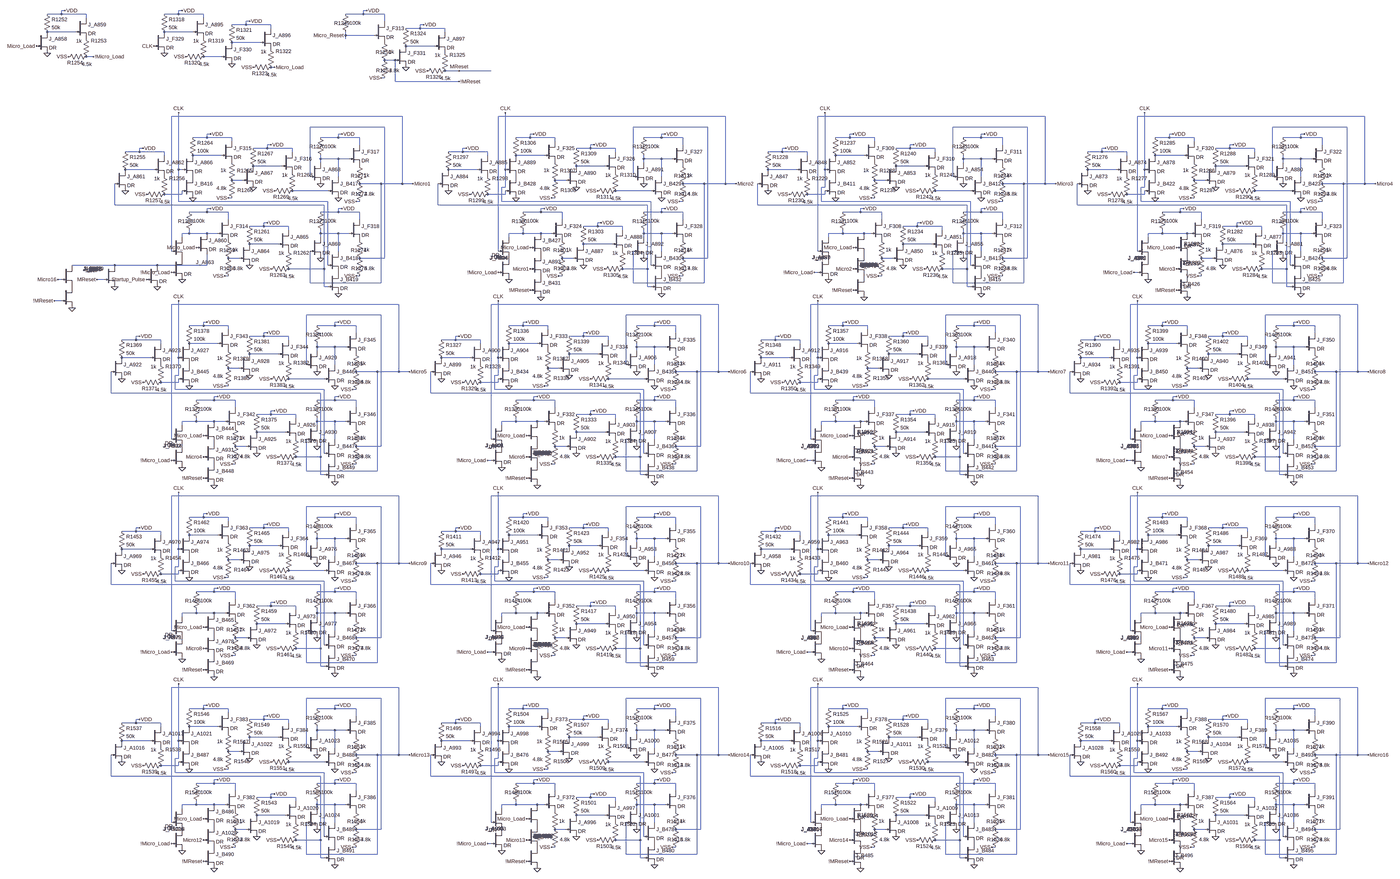
[diagram p0: schematic step_counter.asc, whole sheet]
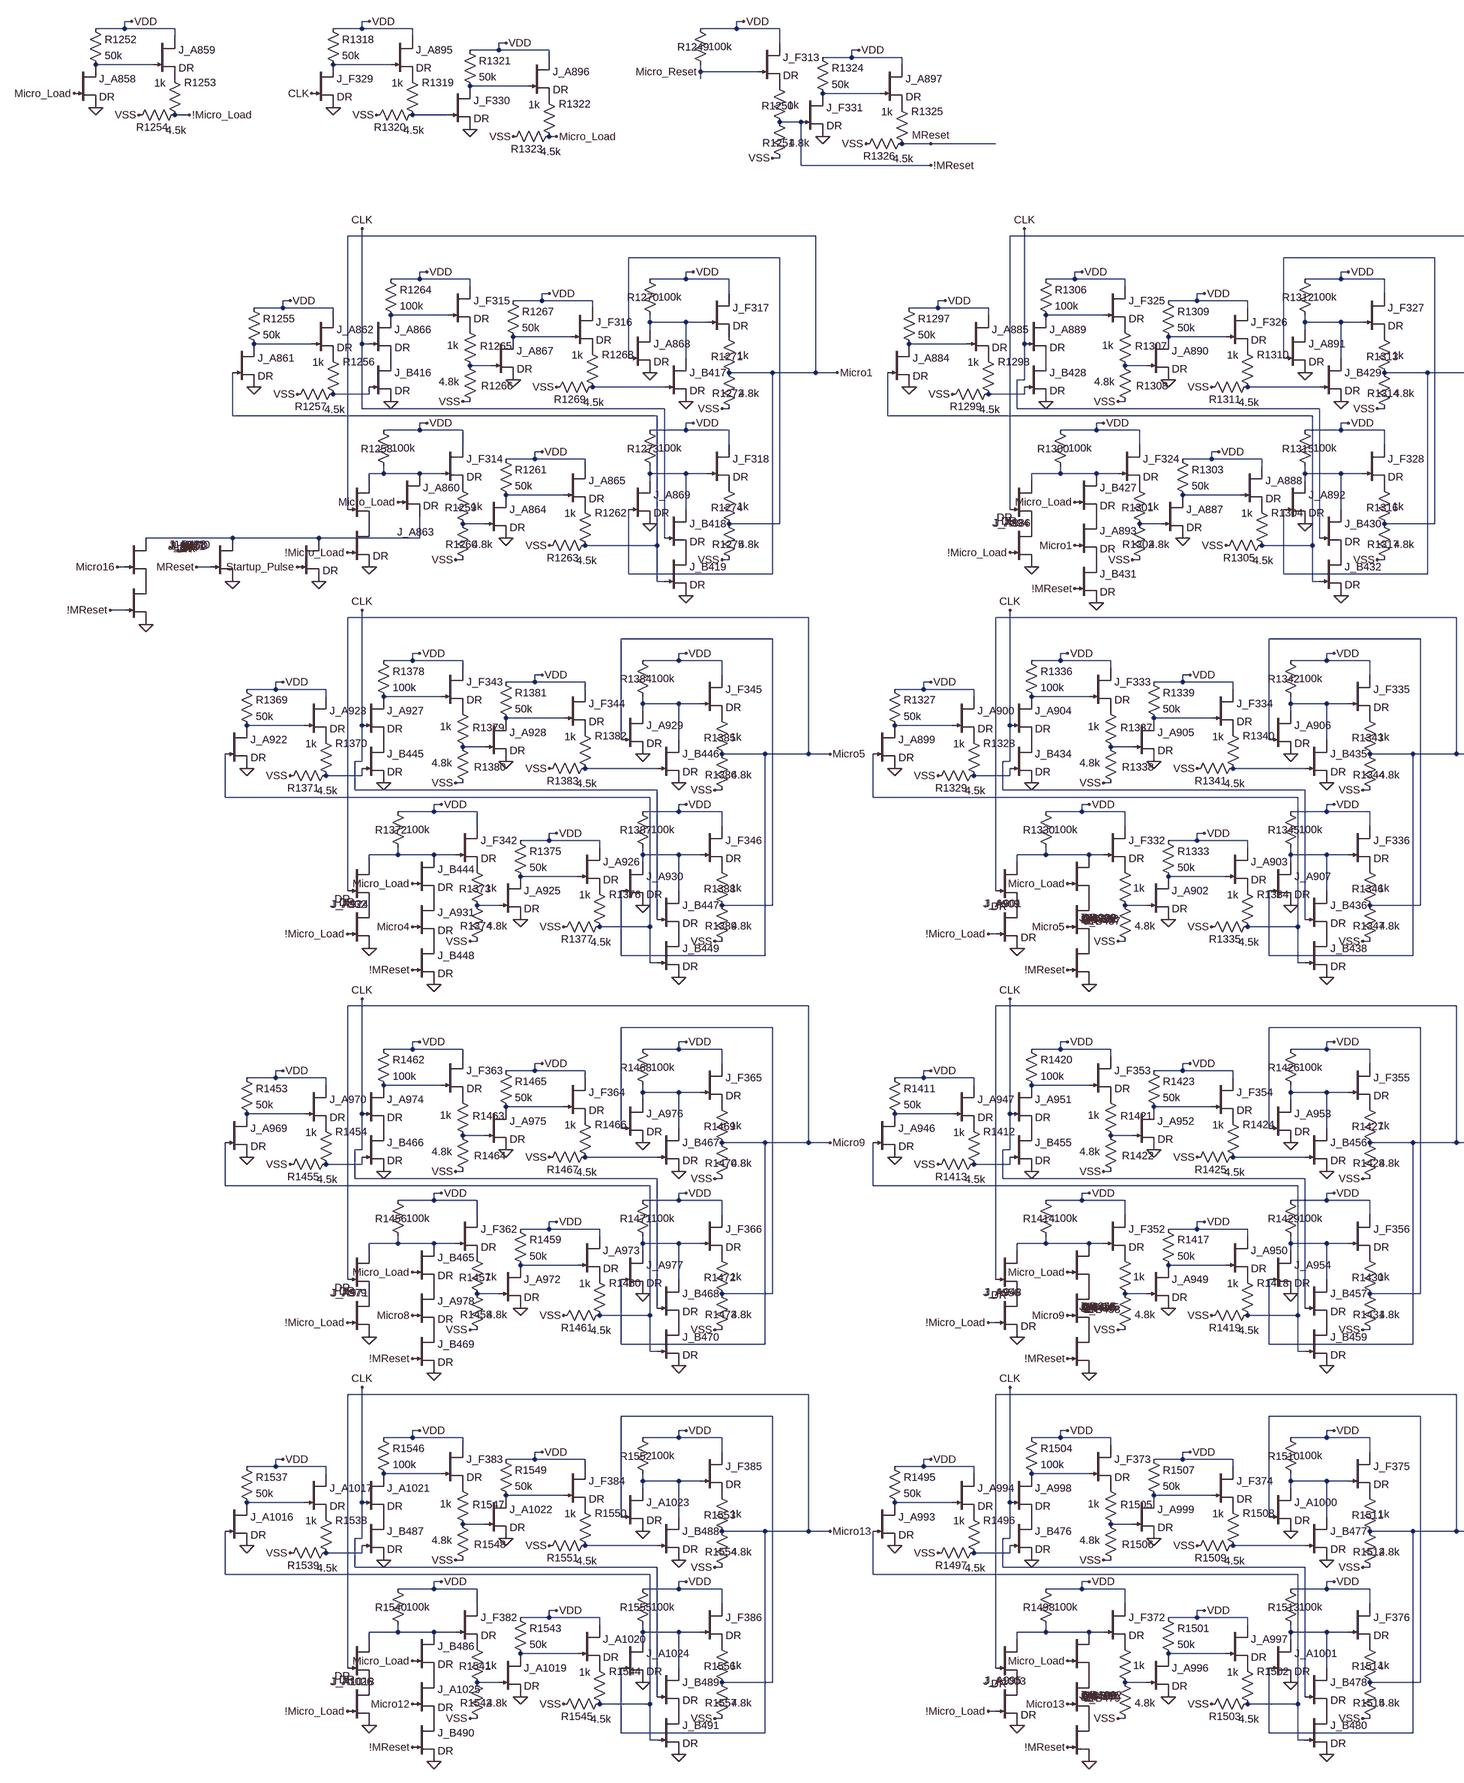
[diagram p1: schematic step_counter.asc, part, row 1 of 1, column 1 of 2]
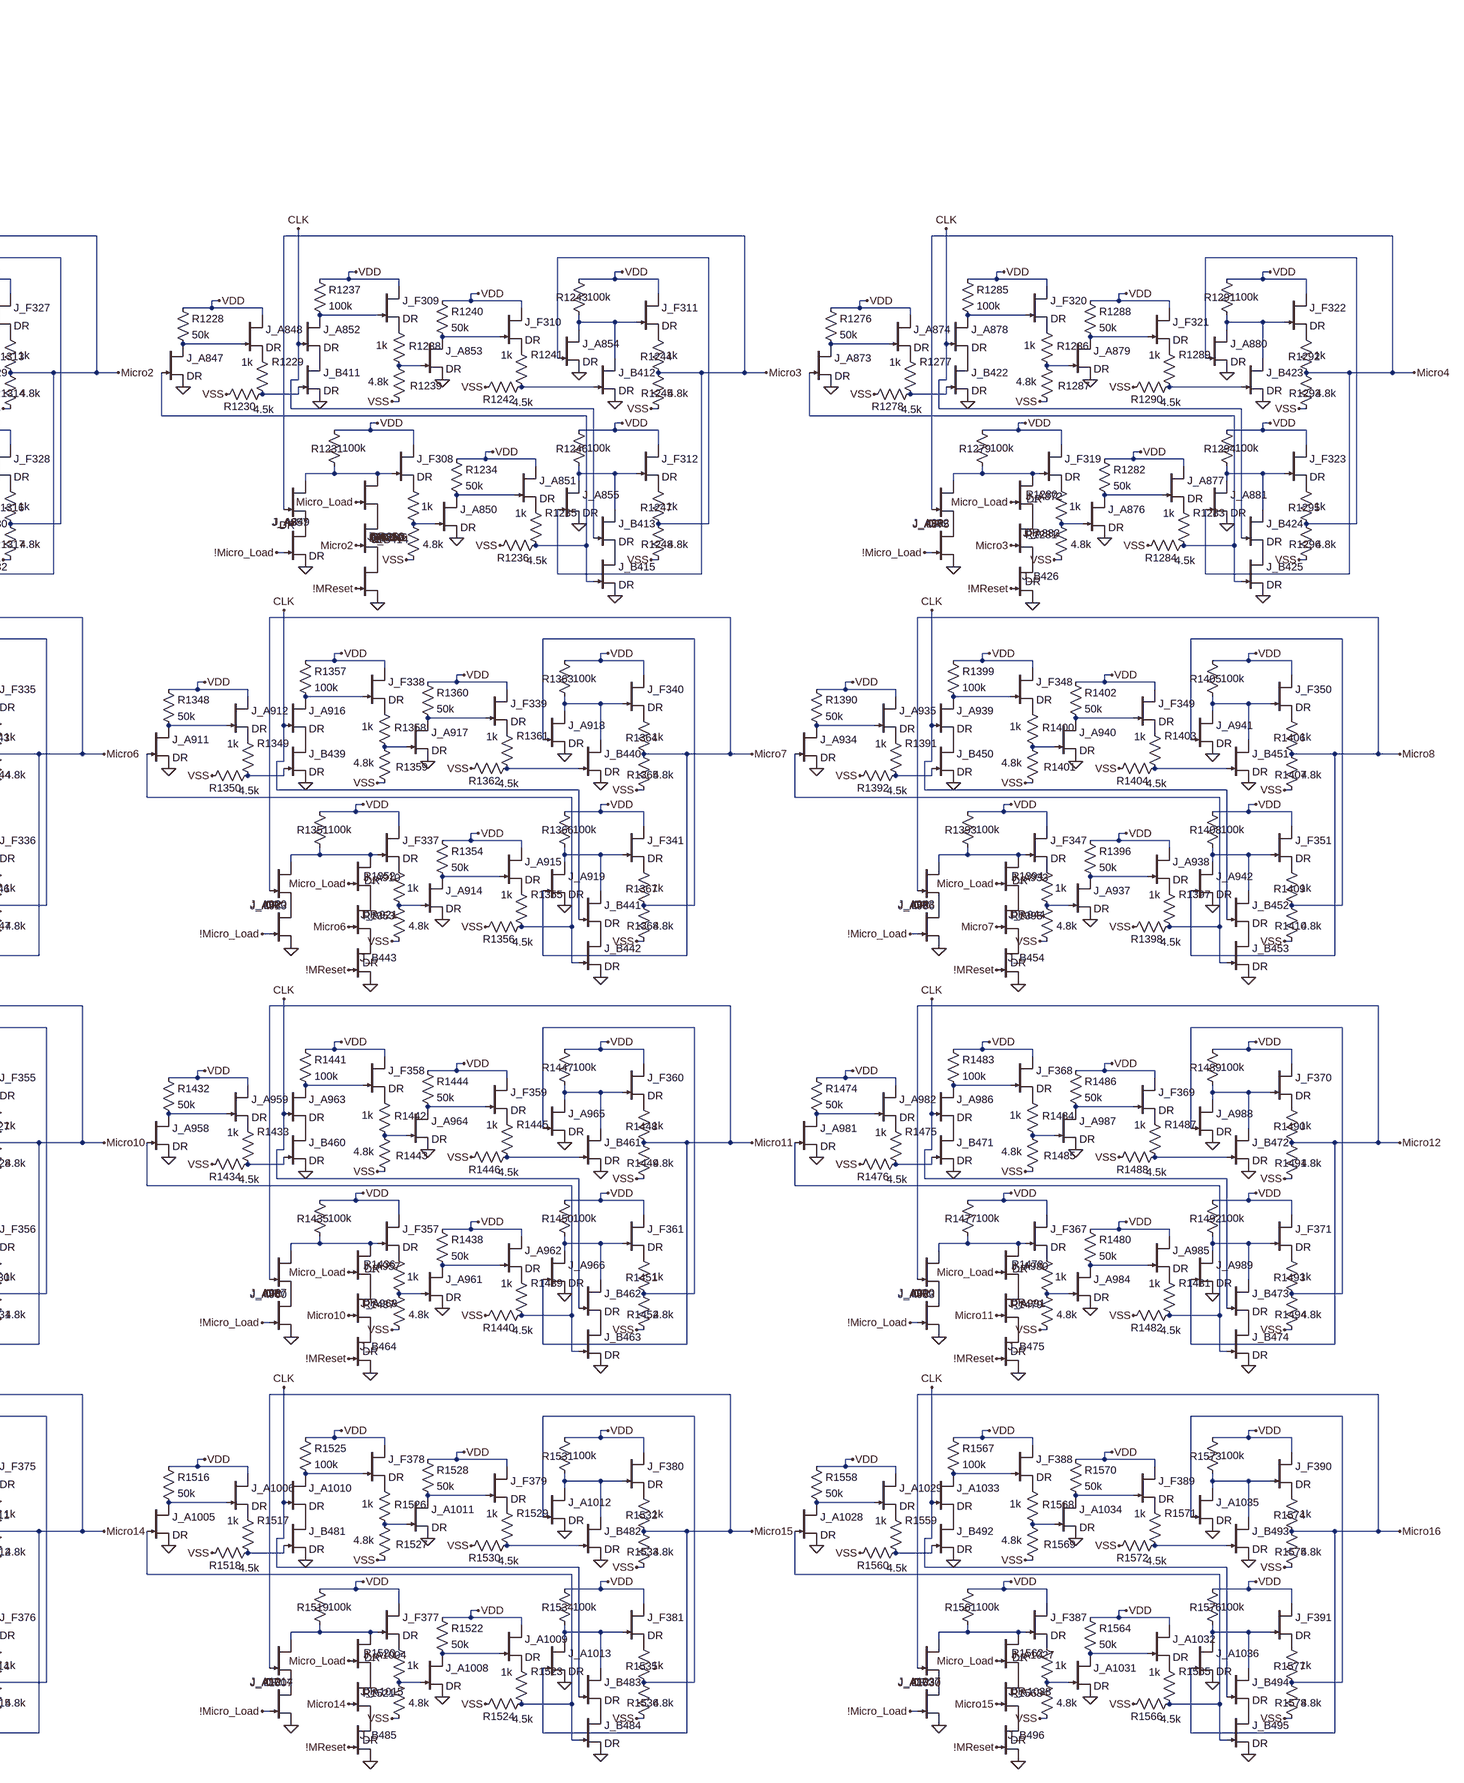
[diagram p2: schematic step_counter.asc, part, row 1 of 1, column 2 of 2]
* step_counter.asc
J_A846 N046 Micro_Load P001 DR
J_A847 N024 N040 0 DR
R1228 VDD N024 50k
J_A848 VDD N024 P002 DR
R1229 P002 N036 1k
R1230 N036 VSS 4.5k
J_A849 P003 !Micro_Load 0 DR
R1231 VDD N046 100k
J_F308 VDD N046 P004 DR
R1232 P004 N056 1k
R1233 N056 VSS 4.8k
J_A850 N052 N056 0 DR
R1234 VDD N052 50k
J_A851 VDD N052 P005 DR
R1235 P005 N040 1k
R1236 N040 VSS 4.5k
J_A852 N012 CLK P006 DR
R1237 VDD N012 100k
J_F309 VDD N012 P007 DR
R1238 P007 N028 1k
R1239 N028 VSS 4.8k
J_B411 P006 N036 0 DR
J_A853 N020 N028 0 DR
R1240 VDD N020 50k
J_F310 VDD N020 P008 DR
R1241 P008 N032 1k
R1242 N032 VSS 4.5k
J_A854 N016 N008 0 DR
R1243 VDD N016 100k
J_F311 VDD N016 P009 DR
R1244 P009 Micro3 1k
R1245 Micro3 VSS 4.8k
J_B412 N016 N032 0 DR
J_A855 N047 Micro3 0 DR
R1246 VDD N047 100k
J_F312 VDD N047 P010 DR
R1247 P010 N008 1k
R1248 N008 VSS 4.8k
J_B413 N047 CLK P011 DR
J_A856 P001 Micro2 P012 DR
J_B414 P012 !MReset 0 DR
R1249 VDD Micro_Reset 100k
J_F313 VDD Micro_Reset P013 DR
R1250 P013 !MReset 1k
R1251 !MReset VSS 4.8k
J_A857 N046 Micro3 P003 DR
J_B415 P011 N040 0 DR
J_A858 N001 Micro_Load 0 DR
R1252 VDD N001 50k
J_A859 VDD N001 P014 DR
R1253 P014 !Micro_Load 1k
R1254 !Micro_Load VSS 4.5k
J_A860 N042 Micro_Load N058 DR
J_A861 N022 N038 0 DR
R1255 VDD N022 50k
J_A862 VDD N022 P015 DR
R1256 P015 N034 1k
R1257 N034 VSS 4.5k
J_A863 P016 !Micro_Load 0 DR
R1258 VDD N042 100k
J_F314 VDD N042 P017 DR
R1259 P017 N054 1k
R1260 N054 VSS 4.8k
J_A864 N050 N054 0 DR
R1261 VDD N050 50k
J_A865 VDD N050 P018 DR
R1262 P018 N038 1k
R1263 N038 VSS 4.5k
J_A866 N010 CLK P019 DR
R1264 VDD N010 100k
J_F315 VDD N010 P020 DR
R1265 P020 N026 1k
R1266 N026 VSS 4.8k
J_B416 P019 N034 0 DR
J_A867 N018 N026 0 DR
R1267 VDD N018 50k
J_F316 VDD N018 P021 DR
R1268 P021 N030 1k
R1269 N030 VSS 4.5k
J_A868 N014 N006 0 DR
R1270 VDD N014 100k
J_F317 VDD N014 P022 DR
R1271 P022 Micro1 1k
R1272 Micro1 VSS 4.8k
J_B417 N014 N030 0 DR
J_A869 N043 Micro1 0 DR
R1273 VDD N043 100k
J_F318 VDD N043 P023 DR
R1274 P023 N006 1k
R1275 N006 VSS 4.8k
J_B418 N043 CLK P024 DR
J_A870 N042 Micro1 P016 DR
J_B419 P024 N038 0 DR
J_B420 N058 Startup_Pulse 0 DR
J_A871 N058 Micro16 P025 DR
J_B421 P025 !MReset 0 DR
J_A872 N048 Micro_Load P026 DR
J_A873 N025 N041 0 DR
R1276 VDD N025 50k
J_A874 VDD N025 P027 DR
R1277 P027 N037 1k
R1278 N037 VSS 4.5k
J_A875 P028 !Micro_Load 0 DR
R1279 VDD N048 100k
J_F319 VDD N048 P029 DR
R1280 P029 N057 1k
R1281 N057 VSS 4.8k
J_A876 N053 N057 0 DR
R1282 VDD N053 50k
J_A877 VDD N053 P030 DR
R1283 P030 N041 1k
R1284 N041 VSS 4.5k
J_A878 N013 CLK P031 DR
R1285 VDD N013 100k
J_F320 VDD N013 P032 DR
R1286 P032 N029 1k
R1287 N029 VSS 4.8k
J_B422 P031 N037 0 DR
J_A879 N021 N029 0 DR
R1288 VDD N021 50k
J_F321 VDD N021 P033 DR
R1289 P033 N033 1k
R1290 N033 VSS 4.5k
J_A880 N017 N009 0 DR
R1291 VDD N017 100k
J_F322 VDD N017 P034 DR
R1292 P034 Micro4 1k
R1293 Micro4 VSS 4.8k
J_B423 N017 N033 0 DR
J_A881 N049 Micro4 0 DR
R1294 VDD N049 100k
J_F323 VDD N049 P035 DR
R1295 P035 N009 1k
R1296 N009 VSS 4.8k
J_B424 N049 CLK P036 DR
J_A882 N048 Micro4 P028 DR
J_B425 P036 N041 0 DR
J_A883 P026 Micro3 P037 DR
J_B426 P037 !MReset 0 DR
J_A884 N023 N039 0 DR
R1297 VDD N023 50k
J_A885 VDD N023 P038 DR
R1298 P038 N035 1k
R1299 N035 VSS 4.5k
J_A886 P039 !Micro_Load 0 DR
R1300 VDD N044 100k
J_F324 VDD N044 P040 DR
R1301 P040 N055 1k
R1302 N055 VSS 4.8k
J_B427 N044 Micro_Load P041 DR
J_A887 N051 N055 0 DR
R1303 VDD N051 50k
J_A888 VDD N051 P042 DR
R1304 P042 N039 1k
R1305 N039 VSS 4.5k
J_A889 N011 CLK P043 DR
R1306 VDD N011 100k
J_F325 VDD N011 P044 DR
R1307 P044 N027 1k
R1308 N027 VSS 4.8k
J_B428 P043 N035 0 DR
J_A890 N019 N027 0 DR
R1309 VDD N019 50k
J_F326 VDD N019 P045 DR
R1310 P045 N031 1k
R1311 N031 VSS 4.5k
J_A891 N015 N007 0 DR
R1312 VDD N015 100k
J_F327 VDD N015 P046 DR
R1313 P046 Micro2 1k
R1314 Micro2 VSS 4.8k
J_B429 N015 N031 0 DR
J_A892 N045 Micro2 0 DR
R1315 VDD N045 100k
J_F328 VDD N045 P047 DR
R1316 P047 N007 1k
R1317 N007 VSS 4.8k
J_B430 N045 CLK P048 DR
J_A893 P041 Micro1 P049 DR
J_B431 P049 !MReset 0 DR
J_A894 N044 Micro2 P039 DR
J_B432 P048 N039 0 DR
R1318 VDD N002 50k
J_A895 VDD N002 P050 DR
R1319 P050 N005 1k
R1320 N005 VSS 4.5k
J_F329 N002 CLK 0 DR
R1321 VDD N003 50k
J_A896 VDD N003 P051 DR
R1322 P051 Micro_Load 1k
R1323 Micro_Load VSS 4.5k
J_F330 N003 N005 0 DR
J_B433 N058 MReset 0 DR
R1324 VDD N004 50k
J_A897 VDD N004 P052 DR
R1325 P052 MReset 1k
R1326 MReset VSS 4.5k
J_F331 N004 !MReset 0 DR
J_A898 N097 Micro_Load P053 DR
J_A899 N076 N092 0 DR
R1327 VDD N076 50k
J_A900 VDD N076 P054 DR
R1328 P054 N088 1k
R1329 N088 VSS 4.5k
J_A901 P055 !Micro_Load 0 DR
R1330 VDD N097 100k
J_F332 VDD N097 P056 DR
R1331 P056 N108 1k
R1332 N108 VSS 4.8k
J_A902 N104 N108 0 DR
R1333 VDD N104 50k
J_A903 VDD N104 P057 DR
R1334 P057 N092 1k
R1335 N092 VSS 4.5k
J_A904 N064 CLK P058 DR
R1336 VDD N064 100k
J_F333 VDD N064 P059 DR
R1337 P059 N080 1k
R1338 N080 VSS 4.8k
J_B434 P058 N088 0 DR
J_A905 N072 N080 0 DR
R1339 VDD N072 50k
J_F334 VDD N072 P060 DR
R1340 P060 N084 1k
R1341 N084 VSS 4.5k
J_A906 N068 N060 0 DR
R1342 VDD N068 100k
J_F335 VDD N068 P061 DR
R1343 P061 Micro6 1k
R1344 Micro6 VSS 4.8k
J_B435 N068 N084 0 DR
J_A907 N098 Micro6 0 DR
R1345 VDD N098 100k
J_F336 VDD N098 P062 DR
R1346 P062 N060 1k
R1347 N060 VSS 4.8k
J_B436 N098 CLK P063 DR
J_A908 P053 Micro5 P064 DR
J_B437 P064 !MReset 0 DR
J_A909 N097 Micro6 P055 DR
J_B438 P063 N092 0 DR
J_A910 N099 Micro_Load P065 DR
J_A911 N077 N093 0 DR
R1348 VDD N077 50k
J_A912 VDD N077 P066 DR
R1349 P066 N089 1k
R1350 N089 VSS 4.5k
J_A913 P067 !Micro_Load 0 DR
R1351 VDD N099 100k
J_F337 VDD N099 P068 DR
R1352 P068 N109 1k
R1353 N109 VSS 4.8k
J_A914 N105 N109 0 DR
R1354 VDD N105 50k
J_A915 VDD N105 P069 DR
R1355 P069 N093 1k
R1356 N093 VSS 4.5k
J_A916 N065 CLK P070 DR
R1357 VDD N065 100k
J_F338 VDD N065 P071 DR
R1358 P071 N081 1k
R1359 N081 VSS 4.8k
J_B439 P070 N089 0 DR
J_A917 N073 N081 0 DR
R1360 VDD N073 50k
J_F339 VDD N073 P072 DR
R1361 P072 N085 1k
R1362 N085 VSS 4.5k
J_A918 N069 N061 0 DR
R1363 VDD N069 100k
J_F340 VDD N069 P073 DR
R1364 P073 Micro7 1k
R1365 Micro7 VSS 4.8k
J_B440 N069 N085 0 DR
J_A919 N100 Micro7 0 DR
R1366 VDD N100 100k
J_F341 VDD N100 P074 DR
R1367 P074 N061 1k
R1368 N061 VSS 4.8k
J_B441 N100 CLK P075 DR
J_A920 N099 Micro7 P067 DR
J_B442 P075 N093 0 DR
J_A921 P065 Micro6 P076 DR
J_B443 P076 !MReset 0 DR
J_A922 N075 N091 0 DR
R1369 VDD N075 50k
J_A923 VDD N075 P077 DR
R1370 P077 N087 1k
R1371 N087 VSS 4.5k
J_A924 P078 !Micro_Load 0 DR
R1372 VDD N095 100k
J_F342 VDD N095 P079 DR
R1373 P079 N107 1k
R1374 N107 VSS 4.8k
J_B444 N095 Micro_Load P080 DR
J_A925 N103 N107 0 DR
R1375 VDD N103 50k
J_A926 VDD N103 P081 DR
R1376 P081 N091 1k
R1377 N091 VSS 4.5k
J_A927 N063 CLK P082 DR
R1378 VDD N063 100k
J_F343 VDD N063 P083 DR
R1379 P083 N079 1k
R1380 N079 VSS 4.8k
J_B445 P082 N087 0 DR
J_A928 N071 N079 0 DR
R1381 VDD N071 50k
J_F344 VDD N071 P084 DR
R1382 P084 N083 1k
R1383 N083 VSS 4.5k
J_A929 N067 N059 0 DR
R1384 VDD N067 100k
J_F345 VDD N067 P085 DR
R1385 P085 Micro5 1k
R1386 Micro5 VSS 4.8k
J_B446 N067 N083 0 DR
J_A930 N096 Micro5 0 DR
R1387 VDD N096 100k
J_F346 VDD N096 P086 DR
R1388 P086 N059 1k
R1389 N059 VSS 4.8k
J_B447 N096 CLK P087 DR
J_A931 P080 Micro4 P088 DR
J_B448 P088 !MReset 0 DR
J_A932 N095 Micro5 P078 DR
J_B449 P087 N091 0 DR
J_A933 N101 Micro_Load P089 DR
J_A934 N078 N094 0 DR
R1390 VDD N078 50k
J_A935 VDD N078 P090 DR
R1391 P090 N090 1k
R1392 N090 VSS 4.5k
J_A936 P091 !Micro_Load 0 DR
R1393 VDD N101 100k
J_F347 VDD N101 P092 DR
R1394 P092 N110 1k
R1395 N110 VSS 4.8k
J_A937 N106 N110 0 DR
R1396 VDD N106 50k
J_A938 VDD N106 P093 DR
R1397 P093 N094 1k
R1398 N094 VSS 4.5k
J_A939 N066 CLK P094 DR
R1399 VDD N066 100k
J_F348 VDD N066 P095 DR
R1400 P095 N082 1k
R1401 N082 VSS 4.8k
J_B450 P094 N090 0 DR
J_A940 N074 N082 0 DR
R1402 VDD N074 50k
J_F349 VDD N074 P096 DR
R1403 P096 N086 1k
R1404 N086 VSS 4.5k
J_A941 N070 N062 0 DR
R1405 VDD N070 100k
J_F350 VDD N070 P097 DR
R1406 P097 Micro8 1k
R1407 Micro8 VSS 4.8k
J_B451 N070 N086 0 DR
J_A942 N102 Micro8 0 DR
R1408 VDD N102 100k
J_F351 VDD N102 P098 DR
R1409 P098 N062 1k
R1410 N062 VSS 4.8k
J_B452 N102 CLK P099 DR
J_A943 N101 Micro8 P091 DR
J_B453 P099 N094 0 DR
J_A944 P089 Micro7 P100 DR
J_B454 P100 !MReset 0 DR
J_A945 N149 Micro_Load P101 DR
J_A946 N128 N144 0 DR
R1411 VDD N128 50k
J_A947 VDD N128 P102 DR
R1412 P102 N140 1k
R1413 N140 VSS 4.5k
J_A948 P103 !Micro_Load 0 DR
R1414 VDD N149 100k
J_F352 VDD N149 P104 DR
R1415 P104 N160 1k
R1416 N160 VSS 4.8k
J_A949 N156 N160 0 DR
R1417 VDD N156 50k
J_A950 VDD N156 P105 DR
R1418 P105 N144 1k
R1419 N144 VSS 4.5k
J_A951 N116 CLK P106 DR
R1420 VDD N116 100k
J_F353 VDD N116 P107 DR
R1421 P107 N132 1k
R1422 N132 VSS 4.8k
J_B455 P106 N140 0 DR
J_A952 N124 N132 0 DR
R1423 VDD N124 50k
J_F354 VDD N124 P108 DR
R1424 P108 N136 1k
R1425 N136 VSS 4.5k
J_A953 N120 N112 0 DR
R1426 VDD N120 100k
J_F355 VDD N120 P109 DR
R1427 P109 Micro10 1k
R1428 Micro10 VSS 4.8k
J_B456 N120 N136 0 DR
J_A954 N150 Micro10 0 DR
R1429 VDD N150 100k
J_F356 VDD N150 P110 DR
R1430 P110 N112 1k
R1431 N112 VSS 4.8k
J_B457 N150 CLK P111 DR
J_A955 P101 Micro9 P112 DR
J_B458 P112 !MReset 0 DR
J_A956 N149 Micro10 P103 DR
J_B459 P111 N144 0 DR
J_A957 N151 Micro_Load P113 DR
J_A958 N129 N145 0 DR
R1432 VDD N129 50k
J_A959 VDD N129 P114 DR
R1433 P114 N141 1k
R1434 N141 VSS 4.5k
J_A960 P115 !Micro_Load 0 DR
R1435 VDD N151 100k
J_F357 VDD N151 P116 DR
R1436 P116 N161 1k
R1437 N161 VSS 4.8k
J_A961 N157 N161 0 DR
R1438 VDD N157 50k
J_A962 VDD N157 P117 DR
R1439 P117 N145 1k
R1440 N145 VSS 4.5k
J_A963 N117 CLK P118 DR
R1441 VDD N117 100k
J_F358 VDD N117 P119 DR
R1442 P119 N133 1k
R1443 N133 VSS 4.8k
J_B460 P118 N141 0 DR
J_A964 N125 N133 0 DR
R1444 VDD N125 50k
J_F359 VDD N125 P120 DR
R1445 P120 N137 1k
R1446 N137 VSS 4.5k
J_A965 N121 N113 0 DR
R1447 VDD N121 100k
J_F360 VDD N121 P121 DR
R1448 P121 Micro11 1k
R1449 Micro11 VSS 4.8k
J_B461 N121 N137 0 DR
J_A966 N152 Micro11 0 DR
R1450 VDD N152 100k
J_F361 VDD N152 P122 DR
R1451 P122 N113 1k
R1452 N113 VSS 4.8k
J_B462 N152 CLK P123 DR
J_A967 N151 Micro11 P115 DR
J_B463 P123 N145 0 DR
J_A968 P113 Micro10 P124 DR
J_B464 P124 !MReset 0 DR
J_A969 N127 N143 0 DR
R1453 VDD N127 50k
J_A970 VDD N127 P125 DR
R1454 P125 N139 1k
R1455 N139 VSS 4.5k
J_A971 P126 !Micro_Load 0 DR
R1456 VDD N147 100k
J_F362 VDD N147 P127 DR
R1457 P127 N159 1k
R1458 N159 VSS 4.8k
J_B465 N147 Micro_Load P128 DR
J_A972 N155 N159 0 DR
R1459 VDD N155 50k
J_A973 VDD N155 P129 DR
R1460 P129 N143 1k
R1461 N143 VSS 4.5k
J_A974 N115 CLK P130 DR
R1462 VDD N115 100k
J_F363 VDD N115 P131 DR
R1463 P131 N131 1k
R1464 N131 VSS 4.8k
J_B466 P130 N139 0 DR
J_A975 N123 N131 0 DR
R1465 VDD N123 50k
J_F364 VDD N123 P132 DR
R1466 P132 N135 1k
R1467 N135 VSS 4.5k
J_A976 N119 N111 0 DR
R1468 VDD N119 100k
J_F365 VDD N119 P133 DR
R1469 P133 Micro9 1k
R1470 Micro9 VSS 4.8k
J_B467 N119 N135 0 DR
J_A977 N148 Micro9 0 DR
R1471 VDD N148 100k
J_F366 VDD N148 P134 DR
R1472 P134 N111 1k
R1473 N111 VSS 4.8k
J_B468 N148 CLK P135 DR
J_A978 P128 Micro8 P136 DR
J_B469 P136 !MReset 0 DR
J_A979 N147 Micro9 P126 DR
J_B470 P135 N143 0 DR
J_A980 N153 Micro_Load P137 DR
J_A981 N130 N146 0 DR
R1474 VDD N130 50k
J_A982 VDD N130 P138 DR
R1475 P138 N142 1k
R1476 N142 VSS 4.5k
J_A983 P139 !Micro_Load 0 DR
R1477 VDD N153 100k
J_F367 VDD N153 P140 DR
R1478 P140 N162 1k
R1479 N162 VSS 4.8k
J_A984 N158 N162 0 DR
R1480 VDD N158 50k
J_A985 VDD N158 P141 DR
R1481 P141 N146 1k
R1482 N146 VSS 4.5k
J_A986 N118 CLK P142 DR
R1483 VDD N118 100k
J_F368 VDD N118 P143 DR
R1484 P143 N134 1k
R1485 N134 VSS 4.8k
J_B471 P142 N142 0 DR
J_A987 N126 N134 0 DR
R1486 VDD N126 50k
J_F369 VDD N126 P144 DR
R1487 P144 N138 1k
R1488 N138 VSS 4.5k
J_A988 N122 N114 0 DR
R1489 VDD N122 100k
J_F370 VDD N122 P145 DR
R1490 P145 Micro12 1k
R1491 Micro12 VSS 4.8k
J_B472 N122 N138 0 DR
J_A989 N154 Micro12 0 DR
R1492 VDD N154 100k
J_F371 VDD N154 P146 DR
R1493 P146 N114 1k
R1494 N114 VSS 4.8k
J_B473 N154 CLK P147 DR
J_A990 N153 Micro12 P139 DR
J_B474 P147 N146 0 DR
J_A991 P137 Micro11 P148 DR
J_B475 P148 !MReset 0 DR
J_A992 N201 Micro_Load P149 DR
J_A993 N180 N196 0 DR
R1495 VDD N180 50k
J_A994 VDD N180 P150 DR
R1496 P150 N192 1k
R1497 N192 VSS 4.5k
J_A995 P151 !Micro_Load 0 DR
R1498 VDD N201 100k
J_F372 VDD N201 P152 DR
R1499 P152 N212 1k
R1500 N212 VSS 4.8k
J_A996 N208 N212 0 DR
R1501 VDD N208 50k
J_A997 VDD N208 P153 DR
R1502 P153 N196 1k
R1503 N196 VSS 4.5k
J_A998 N168 CLK P154 DR
R1504 VDD N168 100k
J_F373 VDD N168 P155 DR
R1505 P155 N184 1k
R1506 N184 VSS 4.8k
J_B476 P154 N192 0 DR
J_A999 N176 N184 0 DR
R1507 VDD N176 50k
J_F374 VDD N176 P156 DR
R1508 P156 N188 1k
R1509 N188 VSS 4.5k
J_A1000 N172 N164 0 DR
R1510 VDD N172 100k
J_F375 VDD N172 P157 DR
R1511 P157 Micro14 1k
R1512 Micro14 VSS 4.8k
J_B477 N172 N188 0 DR
J_A1001 N202 Micro14 0 DR
R1513 VDD N202 100k
J_F376 VDD N202 P158 DR
R1514 P158 N164 1k
R1515 N164 VSS 4.8k
J_B478 N202 CLK P159 DR
J_A1002 P149 Micro13 P160 DR
J_B479 P160 !MReset 0 DR
J_A1003 N201 Micro14 P151 DR
J_B480 P159 N196 0 DR
J_A1004 N203 Micro_Load P161 DR
J_A1005 N181 N197 0 DR
R1516 VDD N181 50k
J_A1006 VDD N181 P162 DR
R1517 P162 N193 1k
R1518 N193 VSS 4.5k
J_A1007 P163 !Micro_Load 0 DR
R1519 VDD N203 100k
J_F377 VDD N203 P164 DR
R1520 P164 N213 1k
R1521 N213 VSS 4.8k
J_A1008 N209 N213 0 DR
R1522 VDD N209 50k
J_A1009 VDD N209 P165 DR
R1523 P165 N197 1k
R1524 N197 VSS 4.5k
J_A1010 N169 CLK P166 DR
R1525 VDD N169 100k
J_F378 VDD N169 P167 DR
R1526 P167 N185 1k
R1527 N185 VSS 4.8k
J_B481 P166 N193 0 DR
J_A1011 N177 N185 0 DR
R1528 VDD N177 50k
J_F379 VDD N177 P168 DR
R1529 P168 N189 1k
R1530 N189 VSS 4.5k
J_A1012 N173 N165 0 DR
R1531 VDD N173 100k
J_F380 VDD N173 P169 DR
R1532 P169 Micro15 1k
R1533 Micro15 VSS 4.8k
J_B482 N173 N189 0 DR
J_A1013 N204 Micro15 0 DR
R1534 VDD N204 100k
J_F381 VDD N204 P170 DR
R1535 P170 N165 1k
R1536 N165 VSS 4.8k
J_B483 N204 CLK P171 DR
J_A1014 N203 Micro15 P163 DR
J_B484 P171 N197 0 DR
J_A1015 P161 Micro14 P172 DR
J_B485 P172 !MReset 0 DR
J_A1016 N179 N195 0 DR
R1537 VDD N179 50k
J_A1017 VDD N179 P173 DR
R1538 P173 N191 1k
R1539 N191 VSS 4.5k
J_A1018 P174 !Micro_Load 0 DR
R1540 VDD N199 100k
J_F382 VDD N199 P175 DR
R1541 P175 N211 1k
R1542 N211 VSS 4.8k
J_B486 N199 Micro_Load P176 DR
J_A1019 N207 N211 0 DR
R1543 VDD N207 50k
J_A1020 VDD N207 P177 DR
R1544 P177 N195 1k
R1545 N195 VSS 4.5k
J_A1021 N167 CLK P178 DR
R1546 VDD N167 100k
J_F383 VDD N167 P179 DR
R1547 P179 N183 1k
R1548 N183 VSS 4.8k
J_B487 P178 N191 0 DR
J_A1022 N175 N183 0 DR
R1549 VDD N175 50k
J_F384 VDD N175 P180 DR
R1550 P180 N187 1k
R1551 N187 VSS 4.5k
J_A1023 N171 N163 0 DR
R1552 VDD N171 100k
J_F385 VDD N171 P181 DR
R1553 P181 Micro13 1k
R1554 Micro13 VSS 4.8k
J_B488 N171 N187 0 DR
J_A1024 N200 Micro13 0 DR
R1555 VDD N200 100k
J_F386 VDD N200 P182 DR
R1556 P182 N163 1k
R1557 N163 VSS 4.8k
J_B489 N200 CLK P183 DR
J_A1025 P176 Micro12 P184 DR
J_B490 P184 !MReset 0 DR
J_A1026 N199 Micro13 P174 DR
J_B491 P183 N195 0 DR
J_A1027 N205 Micro_Load P185 DR
J_A1028 N182 N198 0 DR
R1558 VDD N182 50k
J_A1029 VDD N182 P186 DR
R1559 P186 N194 1k
R1560 N194 VSS 4.5k
J_A1030 P187 !Micro_Load 0 DR
R1561 VDD N205 100k
J_F387 VDD N205 P188 DR
R1562 P188 N214 1k
R1563 N214 VSS 4.8k
J_A1031 N210 N214 0 DR
R1564 VDD N210 50k
J_A1032 VDD N210 P189 DR
R1565 P189 N198 1k
R1566 N198 VSS 4.5k
J_A1033 N170 CLK P190 DR
R1567 VDD N170 100k
J_F388 VDD N170 P191 DR
R1568 P191 N186 1k
R1569 N186 VSS 4.8k
J_B492 P190 N194 0 DR
J_A1034 N178 N186 0 DR
R1570 VDD N178 50k
J_F389 VDD N178 P192 DR
R1571 P192 N190 1k
R1572 N190 VSS 4.5k
J_A1035 N174 N166 0 DR
R1573 VDD N174 100k
J_F390 VDD N174 P193 DR
R1574 P193 Micro16 1k
R1575 Micro16 VSS 4.8k
J_B493 N174 N190 0 DR
J_A1036 N206 Micro16 0 DR
R1576 VDD N206 100k
J_F391 VDD N206 P194 DR
R1577 P194 N166 1k
R1578 N166 VSS 4.8k
J_B494 N206 CLK P195 DR
J_A1037 N205 Micro16 P187 DR
J_B495 P195 N198 0 DR
J_A1038 P185 Micro15 P196 DR
J_B496 P196 !MReset 0 DR
.model NJF NJF
.model PJF PJF
.lib standard.jft
.backanno
.end